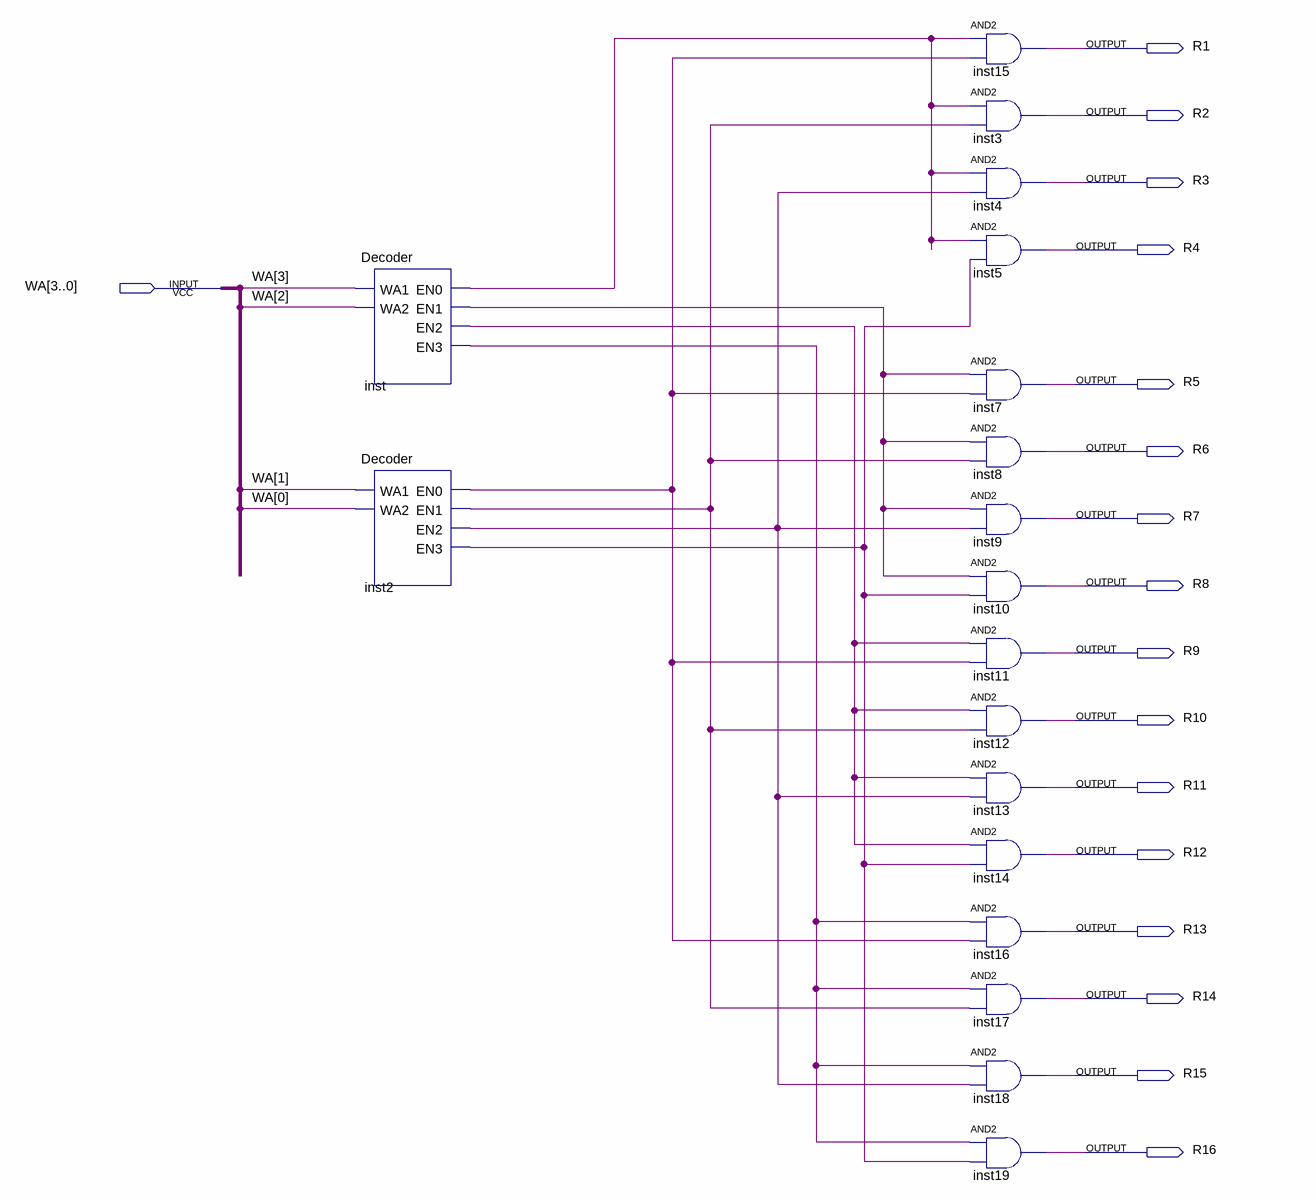
[diagram p0: schematic sheet]
// Quartus schematic FourToSixteenDecoder.bdf as structural Verilog: 18 symbols, 17 pins
module FourToSixteenDecoder (
  input  [3:0] WA,
  output R1,
  output R2,
  output R3,
  output R4,
  output R5,
  output R6,
  output R7,
  output R8,
  output R9,
  output R10,
  output R11,
  output R12,
  output R13,
  output R14,
  output R15,
  output R16
);

  wire inst2_en0, inst2_en1, inst2_en2, inst2_en3, inst_en0, inst_en1, inst_en2, inst_en3;

  Decoder inst (.WA1(WA[3]), .WA2(WA[2]), .EN0(inst_en0), .EN1(inst_en1), .EN2(inst_en2), .EN3(inst_en3));
  Decoder inst2 (.WA1(WA[1]), .WA2(WA[0]), .EN0(inst2_en0), .EN1(inst2_en1), .EN2(inst2_en2), .EN3(inst2_en3));
  and inst15 (R1, inst_en0, inst2_en0);
  and inst3 (R2, inst_en0, inst2_en1);
  and inst4 (R3, inst_en0, inst2_en2);
  and inst5 (R4, inst_en0, inst2_en3);
  and inst7 (R5, inst_en1, inst2_en0);
  and inst8 (R6, inst_en1, inst2_en1);
  and inst9 (R7, inst_en1, inst2_en2);
  and inst10 (R8, inst_en1, inst2_en3);
  and inst11 (R9, inst_en2, inst2_en0);
  and inst12 (R10, inst_en2, inst2_en1);
  and inst13 (R11, inst_en2, inst2_en2);
  and inst14 (R12, inst_en2, inst2_en3);
  and inst16 (R13, inst_en3, inst2_en0);
  and inst17 (R14, inst_en3, inst2_en1);
  and inst18 (R15, inst_en3, inst2_en2);
  and inst19 (R16, inst_en3, inst2_en3);
endmodule
